# Altium schematic sheet Micro_USB_B.SchDoc
size A4; SheetNumber: 2; SheetTotal: 6
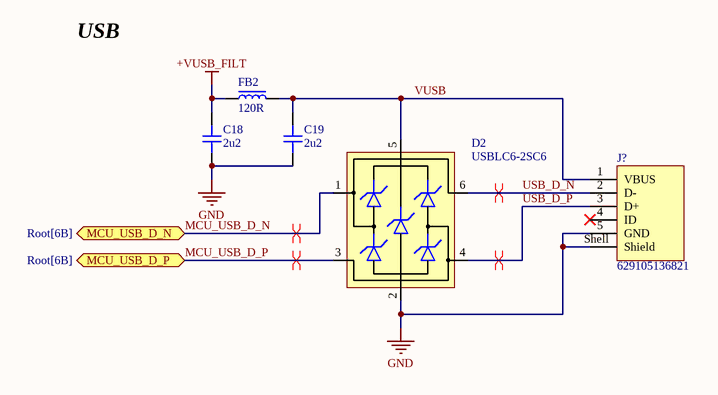
[diagram p0: Micro_USB_B.SchDoc]

## Parts
C18  2u2  [CAP_0603]
C19  2u2  [CAP_0603]
D2  USBLC6-2SC6  [SOT-23-6]
FB2  120R  [FB_0603]
J?  629105136821  [629105136821]

## Ports
MCU_USB_D_N (bidir, see Root[6B]), MCU_USB_D_P (bidir, see Root[6B])

## Nets
+VUSB_FILT: C18.2 FB2.1
GND: C18.1 C19.1 D2.2(GND) J?.5(GND) J?.Shell(Shield)
MCU_USB_D_N: D2.1(IO1) ; port MCU_USB_D_N
MCU_USB_D_P: D2.3(IO2) ; port MCU_USB_D_P
USB_D_N: D2.6(IO1) J?.2(D-)
USB_D_P: D2.4(IO2) J?.3(D+)
VUSB: C19.2 D2.5(VBUS) FB2.2 J?.1(VBUS)

Not connected (* = marked no-connect by the designer): J? 4(ID)*

## Layout directives
differential pair: MCU_USB_D_N, MCU_USB_D_P, USB_D_N, USB_D_P

## Notes on the sheet
- USB

## Library data of the parts
C18 C19 = CAP_0603: 16V; Manufacturer: *; Manufacturer Part Number: *; Distributor Link: *; LCSC: *; Rating: *; Dielectric: *
D2 = USBLC6-2SC6: Low-Capacitance ESD Protection USB; Manufacturer: STMicroelectronics; Manufacturer Part Number: USBLC6-2SC6; Distributor Link: https://www.mouser.de/ProductDetail/STMicroelectronics/USBLC6-2SC6?qs=po45yt2pPpu%2FhNIlwQdTlg%3D%3D
FB2 = FB_0603: 30mOhm; Manufacturer: *; Manufacturer Part Number: *; Distributor Link: *; LCSC: *
J? = CMP-1502-03253-2: NexarPartId: 19991173; Insulation Resistance: 1GΩ; Contact Resistance: 30mΩ; Number of Contacts: 5; Number of Ports: 1; Gender: Receptacle; Current Rating: 1A; Connector Type: USB; Voltage Rating: 30V; USB Standard: USB 2.0; Plating: Nickel; Max Operating Temperature: 105°C; Orientation: Horizontal; Height: 2.9mm; Termination: Solder; Min Operating Temperature: -40°C; Number of Pins: 5; Flammability Rating: UL94 V-0; Lead Free: Lead Free; Packaging: Tape and Reel; Contact Plating: Gold; RoHS: Compliant; Mount: Horizontal, Surface Mount; Color: Black; REACH SVHC: Unknown; Operating Supply Voltage: 30V; Contact Material: Copper; Number of Positions: 5; Length: 5.9mm